# EAGLE design TDA7052AT BRK (EAGLE 8.1.1)
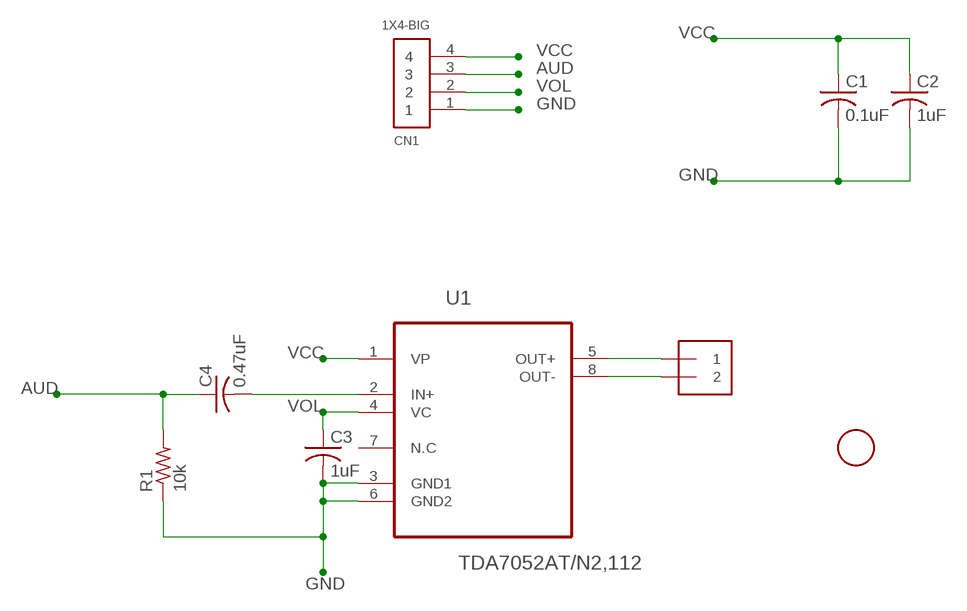
[diagram p0: schematic, sheet 1]

## Parts
C1  0.1uF  C-USC0603K  [C0603K]
C2  1uF  C-USC0603K  [C0603K]
C3  1uF  C-USC0603K  [C0603K]
C4  0.47uF  C-USC0805K  [C0805K]
CN1  1X4-BIG  [1X04-BIG]
J1  1X2-3.5MM  [1X2-3.5MM]
R1  10k  R-US_R0805  [R0805]
U1  TDA7052AT/N2,112  [SOIC127P600X175-8N]
U$1  FIDUCIAL  [FIDUCIAL_1MM]

## Nets
AUD: C4.1 CN1.3 R1.2
GND: C1.2 C2.2 C3.2 CN1.1 R1.1 U1.3(GND1) U1.6(GND2)
N$1: J1.2 U1.8(OUT-)
N$2: J1.1 U1.5(OUT+)
N$10: C4.2 U1.2(IN+)
VCC: C1.1 C2.1 CN1.4 U1.1(VP)
VOL: C3.1 CN1.2 U1.4(VC)
Unconnected: U1.7(N.C)

## Library data of the parts
C1-C4 = adafruit:C-US: CAPACITOR, American symbol
CN1 = adafruit:1X4: 4-pin connector
J1 = adafruit:1X2: 3.5mm Terminal block http://www.ladyada.net/library/pcb/eaglelibrary.html
R1 = adafruit:R-US_: RESISTOR, American symbol
U1 = TDA7052AT:TDA7052AT/N2,112: 1 W BTL mono audio amplifier with DC volume control; MPN: TDA7052AT/N2,112; OC_FARNELL: 1868383; OC_NEWARK: 70R9232; PACKAGE: SOIC-8; SUPPLIER: NXP Semiconductor
U$1 = adafruit:FIDUCIAL: For use by pick and place machines to calibrate the vision/machine, 1mm By microbuilder.eu

## Board
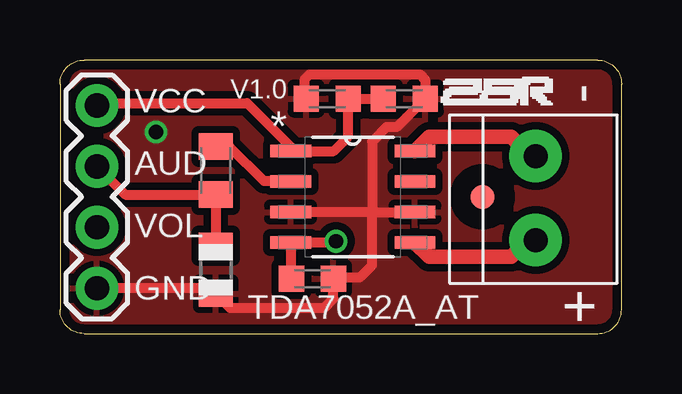
[diagram p1: board, top side]
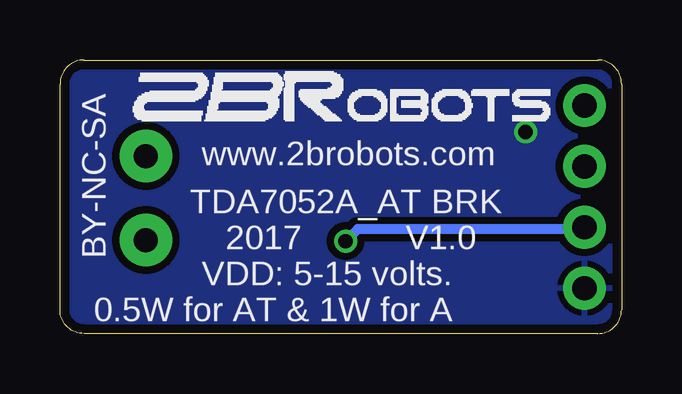
[diagram p2: board, bottom side, seen from below]

Size 23.4 x 11.4 mm. Coordinates in mm from the lower left corner, seen from the top.
Outline: 1,0 22.4,0 arc90 23.4,1 23.4,10.4 arc90 22.4,11.4 1,11.4 arc90 0,10.4 0,1 arc90 1,0
Copper layers (1*16): Top 0.0356mm / dielectric 1.5011mm / Bottom 0.0356mm
Design rules "oshPark *": minimum track width 6mil, minimum drill 13mil, track to track 6mil, track to pad 6mil, pad to pad 6mil, via to via 6mil, smd to smd 6mil, copper to edge 15mil, drill to drill 6mil, minimum pad ring 7mil, minimum via ring 7mil, stop-mask expansion 3mil, vias tented up to drill 25mil, thermal gap 10mil

### Footprints (pad centres in the part's own frame; a part is rotated, then mirrored left to right if it is on the bottom)
C0603K = smd 1.05 x 1.08: 1 -0.875,0; 2 0.875,0
C0805K = smd 1.1 x 1.4: 1 -1,0; 2 1,0
1X04-BIG = drill 1.016 pad 1.778: 1 0,0; 2 2.54,0; 3 5.08,0; 4 7.62,0
1X2-3.5MM = drill 1 pad 2.184: 1 1.8,0; 2 -1.7,0
R0805 = smd 1.1 x 1.4: 1 -1,0; 2 1,0
SOIC127P600X175-8N = smd 1.702 x 0.533: 1 -2.591,1.905; 2 -2.591,0.635; 3 -2.591,-0.635; 4 -2.591,-1.905; 5 2.591,-1.905; 6 2.591,-0.635; 7 2.591,0.635; 8 2.591,1.905
FIDUCIAL_1MM = smd 1 x 1: 1 0,0

### Placement (x,y rotation side)
C1  14.34,9.79 0 top
C2  11.13,9.79 180 top
C3  10.52,2.29 0 top
C4  6.49,6.79 90 top
CN1  1.54,1.89 90 top
J1  19.82,5.7 270 top
R1  6.49,2.66 90 top
U1  12.2,5.7 0 top
U$1  17.6,5.7 0 top

### Tracks (layer width: path | path; a pad name or v marks a point on that pad's centre or on a via)
AUD
  Top 0.406: R1.2 C4.1 2.72,5.79 CN1.3
GND  (via drill 0.6)
  Top 0.406: 13,5.07 U1.3 | 13,5.07 U1.6 | CN1.1 6.26,1.89 R1.1 7.08,1.07 11,1.07 11.39,1.46 C3.2 11.46,2.35 12.5,2.35 13,2.85 13,5.07 | 13,5.07 13,8 13.6,8.6 14.03,8.6 C1.2 15.21,10.59 15,10.8 10.4,10.8 10.2,10.6 10.2,9.85 C2.2
  other vias: 4,8.4
  pour Top (isolate 0.305): 0,11.4 23.6,11.4 23.6,0 0,0
  pour Bottom (isolate 0.305): 0,11.4 0,0 23.4,0 23.4,11.4
N$1
  Top 0.61: U1.8 15.39,8.2 18.8,8.2 19.6,7.4 J1.2
N$2
  Top 0.61: U1.5 15.39,3.2 18.8,3.2 19.5,3.9 J1.1
N$10
  Top 0.406: U1.2 9.59,6.35 8.5,6.35 7.06,7.79 C4.2
VCC
  Top 0.406: CN1.4 1.63,9.6 7.8,9.6 9.61,7.79 U1.1 11.4,7.6 12.01,8.21 C2.1 C1.1
VOL  (via drill 0.6)
  Top 0.406: C3.1 9.61,2.33 U1.4 11.45,3.79 v11.5,3.85
  Bottom 0.406: CN1.2 1.62,4.35 11,4.35 v11.5,3.85

### Text on the board
tPlace: V1.0 | - | VCC | AUD | VOL | GND | TDA7052A_AT | +
bPlace: BY-NC-SA | www.2brobots.com | TDA7052A_AT BRK | V1.0 | 2017 | VDD: 5-15 volts. | 0.5W for AT & 1W for A